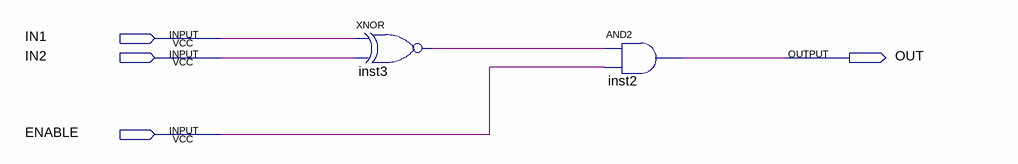
[diagram p0: schematic sheet]
// Quartus schematic Comparator1bit.bdf as structural Verilog: 2 symbols, 4 pins
module Comparator1bit (
  input  IN1,
  input  IN2,
  input  ENABLE,
  output OUT
);

  wire inst3_out;

  xnor inst3 (inst3_out, IN1, IN2);
  and inst2 (OUT, inst3_out, ENABLE);
endmodule
